# EasyEDA Pro project LED_Haptics_Module.eprj

# Schematic OctoSlime
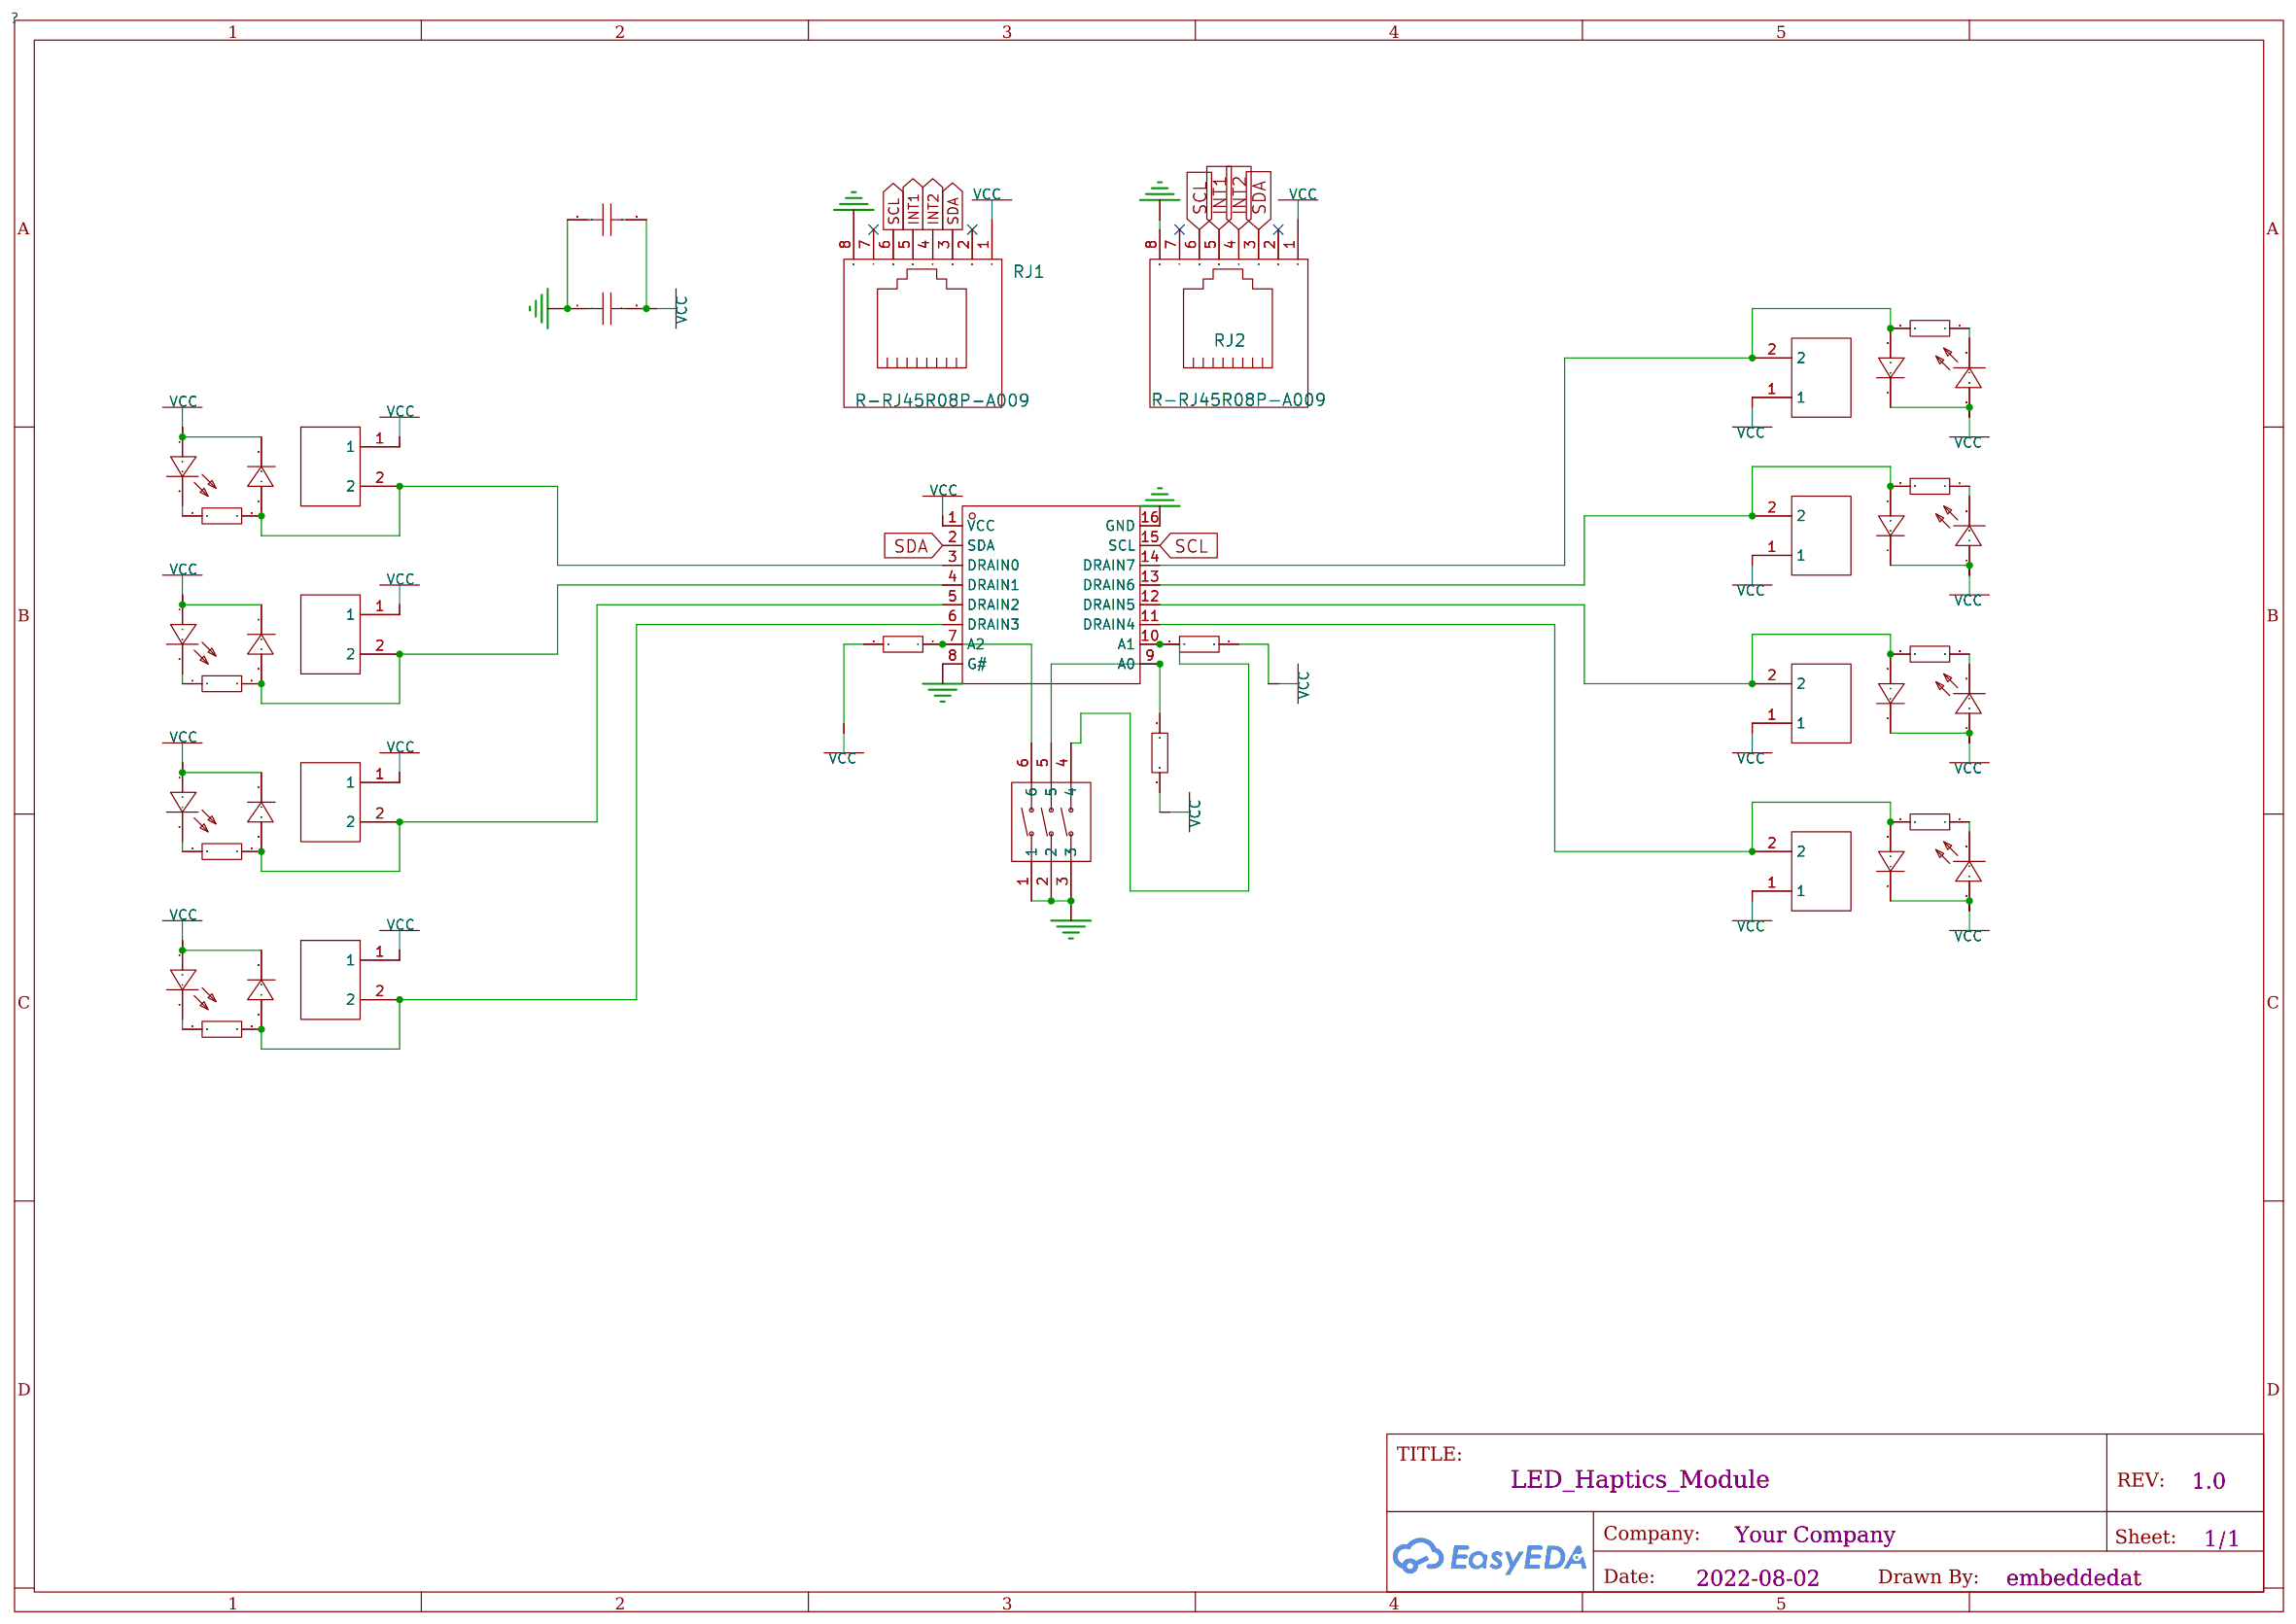
[diagram p0: schematic sheet]

## Parts
C3  47uF  [C1206]
C4  100nF  [C0402]
CN1  B2B-PH-K-S(LF)(SN)  [CONN-TH_B2B-PH-K-S]
CN2  B2B-PH-K-S(LF)(SN)  [CONN-TH_B2B-PH-K-S]
CN3  B2B-PH-K-S(LF)(SN)  [CONN-TH_B2B-PH-K-S]
CN4  B2B-PH-K-S(LF)(SN)  [CONN-TH_B2B-PH-K-S]
CN5  B2B-PH-K-S(LF)(SN)  [CONN-TH_B2B-PH-K-S]
CN6  B2B-PH-K-S(LF)(SN)  [CONN-TH_B2B-PH-K-S]
CN7  B2B-PH-K-S(LF)(SN)  [CONN-TH_B2B-PH-K-S]
CN9  B2B-PH-K-S(LF)(SN)  [CONN-TH_B2B-PH-K-S]
D1  -  [DO-214AC_L4.3-W2.7-LS5.3-RD]
D2  -  [DO-214AC_L4.3-W2.7-LS5.3-RD]
D3  -  [DO-214AC_L4.3-W2.7-LS5.3-RD]
D4  -  [DO-214AC_L4.3-W2.7-LS5.3-RD]
D5  -  [DO-214AC_L4.3-W2.7-LS5.3-RD]
D6  -  [DO-214AC_L4.3-W2.7-LS5.3-RD]
D7  -  [DO-214AC_L4.3-W2.7-LS5.3-RD]
D8  -  [DO-214AC_L4.3-W2.7-LS5.3-RD]
LED1  -  [LED0603-R-RD]
LED2  -  [LED0603-R-RD]
LED3  -  [LED0603-R-RD]
LED4  -  [LED0603-R-RD]
LED5  -  [LED0603-R-RD]
LED6  -  [LED0603-R-RD]
LED7  -  [LED0603-R-RD]
LED8  -  [LED0603-R-RD]
R1  1kΩ  [R0603]
R2  1kΩ  [R0603]
R3  330Ω  [R0603]
R4  330Ω  [R0603]
R5  330Ω  [R0603]
R6  330Ω  [R0603]
R7  330Ω  [R0603]
R8  330Ω  [R0603]
R9  330Ω  [R0603]
R10  330Ω  [R0603]
R20  1kΩ  [R0603]
RJ1  R-RJ45R08P-A009  [RJ45-TH_R-RJ45R08P-A009]
RJ2  R-RJ45R08P-A009  [RJ45-TH_R-RJ45R08P-A009]
SW1  EM-03KP  [SW-SMD_EM-03KP]
U1  TPIC2810DRG4  [SOIC-16_L9.9-W3.9-P1.27-LS6.0-BL]

## Library data of the parts
C3 = CL31A476MPHNNNE: 容值:47uF;精度:±20%;额定电压:10V;温度系数:X5R;; LCSC Part Name: 47uF ±20% 10V; Supplier Part: C96123; Manufacturer: SAMSUNG(三星); Supplier Footprint: 1206; JLCPCB Part Class: Basic Part; Datasheet: https://atta.szlcsc.com/upload/public/pdf/source/20170228/1488267692219.pdf; Supplier: LCSC; Tolerance: ±20%; Voltage Rated: 10V; Temperature Coefficient: X5R
C4 = CL05B104KB54PNC: 容值:100nF;精度:±10%;额定电压:50V;温度系数:X7R;; LCSC Part Name: 100nF ±10% 50V; Supplier Part: C307331; Manufacturer: SAMSUNG(三星); Supplier Footprint: 0402; JLCPCB Part Class: Basic Part; Datasheet: https://atta.szlcsc.com/upload/public/pdf/source/20181009/C307331_222F7C870FD3EA5F46F538B483443886.pdf; Supplier: LCSC; Tolerance: ±10%; Voltage Rated: 50V; Temperature Coefficient: X7R
CN1-CN7 CN9 = B2B-PH-K-S(LF)(SN): link: https://item.szlcsc.com/142630.html; 3DModel: CONN-TH_PH2.00-LI-2P; Supplier: LCSC; Manufacturer: JST; Supplier Part: C131337; JLCPCB Part Class: Extended Part
D1-D8 = M7_C95872: 二极管配置:-;直流反向耐压(Vr):1kV;平均整流电流(Io):1A;正向压降(Vf):1.1V@1A;反向电流(Ir):5A@1kV;; LCSC Part Name: 1kV 1A 1.1V@1A GPP; Supplier Part: C95872; Manufacturer: MDD; Manufacturer Part: M7; Supplier Footprint: SMA(DO-214AC); JLCPCB Part Class: Basic Part; Datasheet: https://atta.szlcsc.com/upload/public/pdf/source/20170221/1487670316366.pdf; Supplier: LCSC; Reverse Voltage (Vr): 1kV; Average Rectified Current (Io): 1A; Forward Voltage (Vf@If): 1.1V@1A; Reverse Leakage Current: 5A@1kV
LED1-LED8 = KT-0603R: 发光颜色:红灯;二极管配置:-;透镜颜色:-;主波长:-;峰值波长:-;色温:-;光通量(25时):-;测试电流:-;正向电压(VF):-;发光强度:-;功率:-;发光角度:-;安装方式:-;工作温度:-40~+85;; LCSC Part Name: 红灯 0603 (90~100mcd); Supplier Part: C2286; Manufacturer: KENTO; Supplier Footprint: 0603; JLCPCB Part Class: Basic Part; Datasheet: https://atta.szlcsc.com/upload/public/pdf/source/20160616/1466072038404.pdf; Supplier: LCSC; Emitted Color: 红灯; Operating Temperature: -40~+85
R1 R2 R20 = 0603WAF1001T5E: 电阻类型:厚膜电阻;阻值:1kΩ;精度:±1%;功率:1/10W;温度系数:±100ppm/;最大工作电压:75V;工作温度范围:-55~+155;; LCSC Part Name: 1kΩ ±1%; Supplier Part: C21190; Manufacturer: UNI-ROYAL(厚声); Supplier Footprint: 0603; JLCPCB Part Class: Basic Part; Datasheet: https://atta.szlcsc.com/upload/public/pdf/source/20200306/C422600_1E6D84923E4A46A82E41ADD87F860B5C.pdf; Supplier: LCSC; Type: 厚膜电阻; Tolerance: ±1%; Power(Watts): 1/10W; Temperature Coefficient: ±100ppm/; Overload Voltage (Max): 75V; Operating Temperature Range: -55~+155
R3-R10 = 0603WAF3300T5E: 电阻类型:厚膜电阻;阻值:330Ω;精度:±1%;功率:1/10W;温度系数:±100ppm/;最大工作电压:75V;工作温度范围:-55~+155;; LCSC Part Name: 330Ω ±1%; Supplier Part: C23138; Manufacturer: UNI-ROYAL(厚声); Supplier Footprint: 0603; JLCPCB Part Class: Basic Part; Datasheet: https://atta.szlcsc.com/upload/public/pdf/source/20200306/C422600_1E6D84923E4A46A82E41ADD87F860B5C.pdf; Supplier: LCSC; Type: 厚膜电阻; Tolerance: ±1%; Power(Watts): 1/10W; Temperature Coefficient: ±100ppm/; Overload Voltage (Max): 75V; Operating Temperature Range: -55~+155
RJ1 RJ2 = R-RJ45R08P-A009: link: https://atta.szlcsc.com/upload/public/pdf/source/20211021/D54662BD8381AD1D1DF920996089EE18.pdf; Supplier: LCSC; Supplier Part: C2902700; Manufacturer: Ckmtw(灿科盟); JLCPCB Part Class: Extended Part
SW1 = EM-03KP: link: https://item.szlcsc.com/140371.html; 3DModel: SW-SMD_EM-03KP-L8.6-W6.3-H4.8-P2.54-LS10.0; Supplier: LCSC; Manufacturer: HRO; Supplier Part: C129079; JLCPCB Part Class: Extended Part
U1 = TPIC2810DRG4: 3DModel: SOIC-16_L9.9-W3.9-H1.8-LS6.0-P1.27; Supplier: LCSC; Supplier Part: C2678987; Manufacturer: TI(德州仪器); JLCPCB Part Class: Extended Part

## Nets
GND: C3.1 C4.1 RJ1.8 RJ2.8 SW1.1 SW1.2 SW1.3 U1.8(G#) U1.16(GND)
VCC: C3.2 C4.2 CN1.1 CN2.1 CN3.1 CN4.1 CN5.1 CN6.1 CN7.1 CN9.1 D1.1(K) D2.1(K) D3.1(K) D4.1(K) D5.1(K) D6.1(K) D7.1(K) D8.1(K) LED1.1(A) LED2.1(A) LED3.1(A) LED4.1(A) LED5.1(A) LED6.1(A) LED7.1(A) LED8.1(A) R1.2 R2.2 R20.1 RJ1.1 RJ2.1 U1.1(VCC)
INT1: RJ1.5 RJ2.5
INT2: RJ1.4 RJ2.4
SCL: RJ1.6 RJ2.6 U1.15(SCL)
SDA: RJ1.3 RJ2.3 U1.2(SDA)
$1N1698: R20.2 SW1.4 U1.10(A1)
$1N1704: R1.1 SW1.5 U1.9(A0)
$1N1718: R2.1 SW1.6 U1.7(A2)
$1N1725: CN3.2 D4.2(A) R6.2 U1.3(DRAIN0)
$1N1752: CN1.2 D2.2(A) R4.2 U1.5(DRAIN2)
$1N1840: CN4.2 D5.2(A) R7.2 U1.14(DRAIN7)
$1N1848: CN5.2 D6.2(A) R8.2 U1.13(DRAIN6)
$1N1856: CN6.2 D7.2(A) R9.2 U1.12(DRAIN5)
$1N24704: CN9.2 D1.2(A) R3.2 U1.6(DRAIN3)
$1N25961: CN2.2 D3.2(A) R5.2 U1.4(DRAIN1)
$1N26082: CN7.2 D8.2(A) R10.2 U1.11(DRAIN4)
$1N30806: LED1.2(K) R3.1
$1N30961: LED2.2(K) R4.1
$1N31148: LED3.2(K) R5.1
$1N31259: LED4.2(K) R6.1
$1N31402: LED5.2(K) R7.1
$1N31541: LED6.2(K) R8.1
$1N31676: LED7.2(K) R9.1
$1N31807: LED8.2(K) R10.1

Not connected (* = marked no-connect by the designer): RJ1 2* 7*; RJ2 2* 7*

# Board PCB_PCB_OctoSlime_2022-08-02
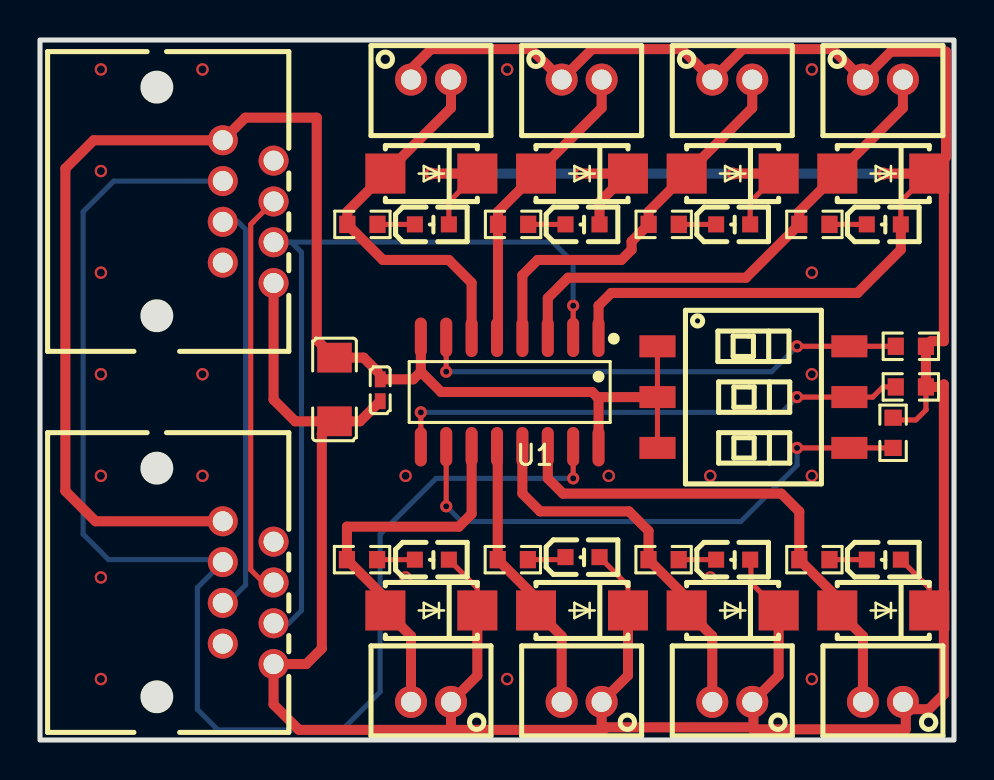
[diagram p1: board, top side]
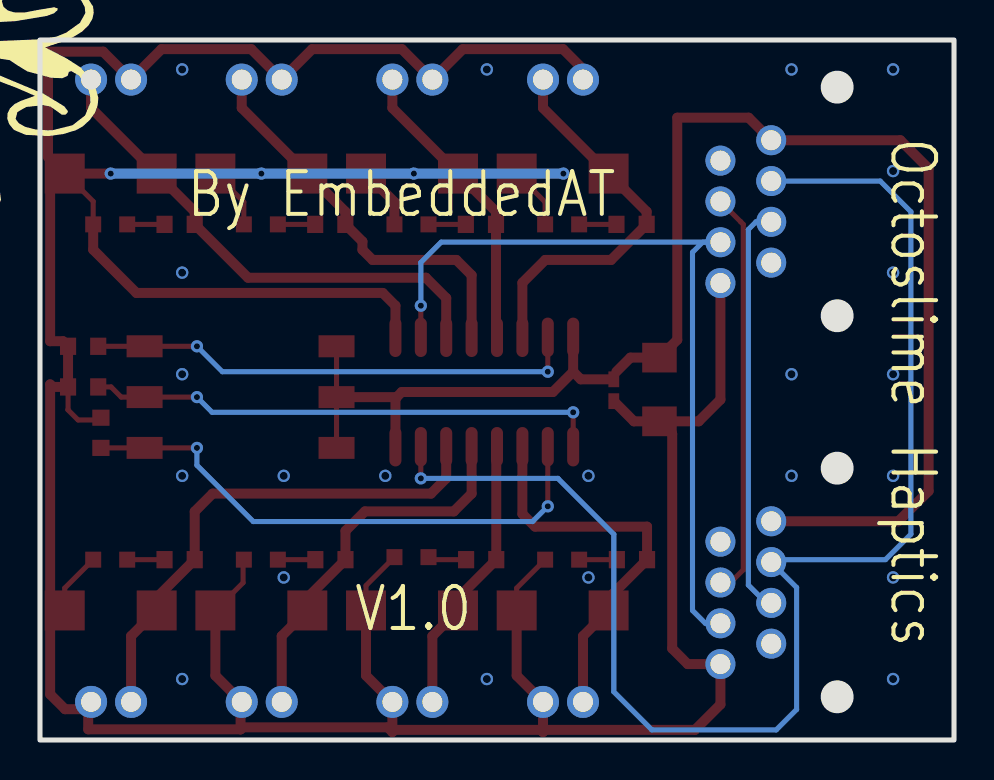
[diagram p2: board, bottom side, seen from below]

Outline 45.72 x 35 mm; copper layers: Top Layer, Bottom Layer. Coordinates in mm from the lower left corner of the outline.
Outline path: rectangle 0,35 45.72,0
Stack: Top Layer 0.035mm / Dielectric1 1.51mm FR4 er 4.5 / Bottom Layer 0.035mm

## Design rules (mm)
spacing Default (default): track to track 0.152, other pairs 0 to 0.152
track width Default (default): min 0.254, default 0.254, max 25.4
differential pair differentialPair (default): width min 0.127, default 0.254, max 2.54; gap min 0.152, default 0.152
via Default (default): diameter min 0.61, default 0.61, max 100.025; hole min 0.305, default 0.305, max 59.995

## Placement (name value [footprint] x y rotation side)
C3  47uF  [C1206]  14.73 17.53 270 top
C4  100nF  [C0402]  17.02 17.49 270 top
CN1  B2B-PH-K-S(LF)(SN)  [CONN-TH_B2B-PH-K-S]  27.09 33.02 180 top
CN2  B2B-PH-K-S(LF)(SN)  [CONN-TH_B2B-PH-K-S]  34.63 33.02 180 top
CN3  B2B-PH-K-S(LF)(SN)  [CONN-TH_B2B-PH-K-S]  42.16 33.02 180 top
CN4  B2B-PH-K-S(LF)(SN)  [CONN-TH_B2B-PH-K-S]  42.16 1.91 0 top
CN5  B2B-PH-K-S(LF)(SN)  [CONN-TH_B2B-PH-K-S]  34.63 1.91 0 top
CN6  B2B-PH-K-S(LF)(SN)  [CONN-TH_B2B-PH-K-S]  27.09 1.91 0 top
CN7  B2B-PH-K-S(LF)(SN)  [CONN-TH_B2B-PH-K-S]  19.56 1.91 0 top
CN9  B2B-PH-K-S(LF)(SN)  [CONN-TH_B2B-PH-K-S]  19.56 33.02 180 top
D1  -  [DO-214AC_L4.3-W2.7-LS5.3-RD]  19.58 28.32 180 top
D2  -  [DO-214AC_L4.3-W2.7-LS5.3-RD]  27.11 28.32 180 top
D3  -  [DO-214AC_L4.3-W2.7-LS5.3-RD]  34.65 28.32 180 top
D4  -  [DO-214AC_L4.3-W2.7-LS5.3-RD]  42.18 28.32 180 top
D5  -  [DO-214AC_L4.3-W2.7-LS5.3-RD]  42.18 6.48 180 top
D6  -  [DO-214AC_L4.3-W2.7-LS5.3-RD]  34.65 6.48 180 top
D7  -  [DO-214AC_L4.3-W2.7-LS5.3-RD]  27.11 6.48 180 top
D8  -  [DO-214AC_L4.3-W2.7-LS5.3-RD]  19.58 6.48 180 top
LED1  -  [LED0603-R-RD]  19.6 25.78 0 top
LED2  -  [LED0603-R-RD]  27.14 25.78 0 top
LED3  -  [LED0603-R-RD]  34.67 25.78 0 top
LED4  -  [LED0603-R-RD]  42.21 25.78 0 top
LED5  -  [LED0603-R-RD]  42.21 9.02 0 top
LED6  -  [LED0603-R-RD]  34.67 9.02 0 top
LED7  -  [LED0603-R-RD]  27.14 9.14 0 top
LED8  -  [LED0603-R-RD]  19.6 9.02 0 top
R1  1kΩ  [R0603]  43.56 17.65 0 top
R2  1kΩ  [R0603]  43.56 19.69 0 top
R3  330Ω  [R0603]  16.13 25.78 180 top
R4  330Ω  [R0603]  23.66 25.78 180 top
R5  330Ω  [R0603]  31.2 25.78 180 top
R6  330Ω  [R0603]  38.73 25.78 180 top
R7  330Ω  [R0603]  38.73 9.02 180 top
R8  330Ω  [R0603]  31.19 9.02 180 top
R9  330Ω  [R0603]  23.65 9.02 180 top
R10  330Ω  [R0603]  16.11 9.02 180 top
R20  1kΩ  [R0603]  42.67 15.36 270 top
RJ1  R-RJ45R08P-A009  [RJ45-TH_R-RJ45R08P-A009]  10.41 7.37 270 top
RJ2  R-RJ45R08P-A009  [RJ45-TH_R-RJ45R08P-A009]  10.41 26.42 270 top
SW1  EM-03KP  [SW-SMD_EM-03KP]  35.69 17.14 270 top
U1  TPIC2810DRG4  [SOIC-16_L9.9-W3.9-P1.27-LS6.0-BL]  23.49 17.4 180 top

## Footprints (pads in the part's own frame, mm; a bottom-side part is the same pattern mirrored in y, then rotated)
C0402
  rect 0.79x0.541 smd: 1(-0.546,0) 2(0.546,0)
C1206
  rect 1.486x1.727 smd: 1(-1.593,0) 2(1.593,0)
CONN-TH_B2B-PH-K-S
  round 1.6 hole 1: 1(1,0) 2(-1,0)
DO-214AC_L4.3-W2.7-LS5.3-RD
  rect 1.999x1.999 smd: 1(-2.299,0) 2(2.301,0)
LED0603-R-RD
  rect 0.8x0.8 smd: 1(0.851,0) 2(-0.851,0)
R0603
  rect 0.807x0.864 smd: 1(-0.754,0) 2(0.754,0)
RJ45-TH_R-RJ45R08P-A009
  round 1.5 hole 1: 1(3.57,1.27) 2(2.55,-1.27) 3(1.53,1.27) 4(0.51,-1.27) 5(-0.51,1.27) 6(-1.53,-1.27) 7(-2.55,1.27) 8(-3.57,-1.27)
SOIC-16_L9.9-W3.9-P1.27-LS6.0-BL
  oval 0.602x1.971 smd: 1(-4.445,-2.736) 2(-3.175,-2.736) 3(-1.905,-2.736) 4(-0.635,-2.736) 5(0.635,-2.736) 6(1.905,-2.736) 7(3.175,-2.736) 8(4.445,-2.736) 9(4.445,2.736) 10(3.175,2.736) 11(1.905,2.736) 12(0.635,2.736) 13(-0.635,2.736) 14(-1.905,2.736) 15(-3.175,2.736) 16(-4.445,2.736)
SW-SMD_EM-03KP
  rect 1.1x1.8 smd: 1(-2.54,-4.8) 2(0,-4.8) 3(2.54,-4.8) 4(2.54,4.8) 5(0,4.8) 6(-2.54,4.8)

## Nets
As in the schematic.

Pads without a net: RJ1 2 7; RJ2 2 7

## Via types
v1: diameter 0.61, hole 0.305, Top Layer to Bottom Layer, 12 vias
v2: diameter 0.62, hole 0.4, Top Layer to Bottom Layer, 22 vias

## Routing (per net, layer and track width the routed paths; a pad name or vN(x,y) marks a point on that pad's centre or on a via; arc(x,y) is an arc through that point)
GND: length 76.9
  Top Layer w0.254: SW1.1 SW1.2 SW1.3 ; 19.05,19.33 U1.8
  Top Layer w0.5: 19.05,18.42 20.07,17.4 27.62,17.4 27.88,17.14 ; 19.05,18.42 18.67,18.03 C4.1 ; 19.05,18.42 19.05,19.33 ; 27.88,17.14 SW1.2 ; 27.88,17.14 27.94,17.08 U1.16 ; 16.89,18.42 16.19,19.12 C3.1 13.84,20.01 13.84,31.11 10.27,31.11 RJ2.8 2.68,29.99 1.27,28.58 1.27,12.45 2.78,10.94 RJ1.8
  vias: v2(3.05,33.53) v2(3.05,28.45) v2(3.05,23.37) v2(3.05,18.29) v2(3.05,13.21) v2(3.05,8.13) v2(3.05,3.05) v2(8.13,33.53) v2(8.13,18.29) v2(8.13,13.21) v2(18.29,13.21) v2(18.29,8.13) v2(23.37,33.53) v2(23.37,3.05) v2(28.45,13.21) v2(33.53,13.21) v2(33.53,8.13) v2(38.61,33.53) v2(38.61,23.37) v2(38.61,18.29) v2(38.61,13.21) v2(38.61,3.05)
VCC: length 230.5
  Top Layer w0.254: D5.1 44.48,7.59 LED5.1 ; 42.67,16.11 42.78,16 43.82,16 44.32,16.51 44.32,16.52 R1.2 ; CN5.1 35.82,1.91 ; LED3.1 35.52,26.9 D3.1 ; 27.99,9.14 29.41,7.72 D7.1 ; 44.45,28.32 43.06,26.93 LED4.1 ; D6.1 35.56,7.86 35.56,8.98 LED6.1 ; LED1.1 20.45,26.9 D1.1 ; D8.1 21.88,7.59 LED8.1
  Top Layer w0.5: 35.69,0.53 35.58,0.64 28.33,0.64 28.09,0.4 ; 35.69,0.53 35.69,1.77 35.82,1.91 ; 35.69,0.53 43.31,0.53 43.31,1.76 ; 28.09,0.4 CN6.1 29.41,3.22 D7.1 ; 28.09,0.4 27.99,0.51 20.66,0.51 20.56,0.4 ; v1(34.65,28.32) D3.1 ; CN9.1 18.56,33.54 19.56,34.54 24.57,34.54 CN1.1 27.62,34.54 32.1,34.54 CN2.1 35.15,34.54 39.64,34.54 CN3.1 42.56,34.42 45.32,34.42 45.32,29.16 D4.1 45.21,27.59 45.21,19.94 44.57,19.94 R2.2 R1.2 45.08,17.65 45.21,17.78 45.21,7.21 D5.1 45.21,5.75 45.21,2.29 44.47,1.54 43.53,1.54 43.31,1.76 ; C3.2 14.1,15.3 14.1,4.57 13.32,3.8 RJ1.1 11.68,1.78 12.95,0.51 20.45,0.51 20.56,0.4 ; C3.2 16.01,15.93 C4.2 ; C3.2 12.77,15.93 11.68,17.02 11.68,22.85 ; 43.31,1.76 CN4.1 ; D6.1 36.95,3.22 CN5.1 ; 20.56,0.4 CN7.1 21.88,3.22 D8.1 ; 27.99,25.78 27.99,26.9 D2.1 v1(27.02,28.32) ; LED4.1 43.06,24.52 40.89,22.35 28.58,22.35 27.94,21.72 U1.1 ; v1(19.54,28.32) D1.1 ; v1(42.18,28.32) 44.45,28.32
  Bottom Layer w0.5: v1(19.54,28.32) v1(27.02,28.32) v1(34.65,28.32) v1(42.18,28.32)
INT1: length 20.3
  Top Layer w0.254: 11.68,26.93 10.67,25.91 10.67,25.91 10.54,25.78 10.54,8.51 11.17,7.88 RJ1.5
INT2: length 20.6
  Bottom Layer w0.254: RJ2.4 9.91,25.91 10.29,25.53 10.29,7.75 9.4,6.86 RJ1.4
SCL: length 69.8
  Top Layer w0.254: U1.15 v1(26.67,13.08)
  Bottom Layer w0.254: v1(26.67,13.08) 19.81,13.08 17.02,10.29 17.02,2.41 15.11,0.51 8.89,0.51 7.87,1.52 7.87,7.63 RJ1.6 9.02,9.02 3.43,9.02 2.16,10.29 2.16,26.42 3.69,27.95 9.14,27.95
SDA: length 40.2
  Top Layer w0.254: v1(26.67,21.72) U1.2
  Bottom Layer w0.254: RJ2.3 11.86,24.89 ; 11.86,24.89 11.86,24.89 25.65,24.89 26.67,23.88 v1(26.67,21.72) ; 11.86,24.89 12.58,24.89 13.08,24.38 13.08,6.48 12.44,5.84 RJ1.3
$1N1698: length 27.7
  Top Layer w0.254: R20.2 SW1.4 v1(37.87,14.61) ; v1(20.32,11.68) U1.10
  Bottom Layer w0.254: v1(20.32,11.68) 21.08,10.92 35.05,10.92 37.87,13.74 v1(37.87,14.61)
$1N1704: length 26
  Top Layer w0.254: v1(19.05,16.38) U1.9 ; R1.1 42.16,17.65 41.66,17.14 SW1.5 v1(37.87,17.14)
  Bottom Layer w0.254: v1(19.05,16.38) 37.11,16.38 v1(37.87,17.14)
$1N1718: length 24.7
  Top Layer w0.254: v1(37.87,19.69) SW1.6 R2.1 ; v1(20.32,18.42) U1.7
  Bottom Layer w0.254: v1(20.32,18.42) 36.6,18.42 v1(37.87,19.69)
$1N1725: length 25.5
  Top Layer w0.5: U1.3 25.4,22.1 26.42,23.11 35.31,23.11 R6.2 37.98,26.42 D4.2 43.16,31.6 CN3.2
$1N1752: length 15.1
  Top Layer w0.5: U1.5 22.91,20.18 22.91,26.42 D2.2 28.09,31.6 CN1.2
$1N1840: length 25.7
  Top Layer w0.5: CN4.2 41.16,5.2 D5.2 39.88,7.11 R7.2 37.98,11.42 37.08,12.32 26.16,12.32 25.4,13.08 U1.14
$1N1848: length 19.3
  Top Layer w0.5: 24.13,14.66 24.13,12.32 25.02,11.43 29.46,11.43 30.44,10.46 R8.2 32.35,7.11 D6.2 33.63,5.2 CN5.2
$1N1856: length 14.1
  Top Layer w0.5: CN6.2 26.09,5.2 D7.2 24.81,7.1 R9.2 22.9,14.63 U1.12
$1N24704: length 19.5
  Top Layer w0.5: U1.6 21.59,22.86 20.45,24 17.15,24 R3.2 15.37,26.42 D1.2 20.56,31.6 CN9.2
$1N25961: length 20.1
  Top Layer w0.5: CN2.2 35.63,31.6 D3.2 30.45,26.42 R5.2 29.59,24.93 29.59,24.51 29.08,24 24.89,24 24.13,23.24 24.13,20.13
$1N26082: length 19.9
  Top Layer w0.5: U1.11 21.59,11.3 20.95,10.67 15.35,10.67 R10.2 17.28,7.09 D8.2 18.56,5.2 CN7.2
$1N30806: length 1.9
  Top Layer w0.254: R3.1 LED1.2
$1N30961: length 1.9
  Top Layer w0.254: R4.1 LED2.2
$1N31148: length 1.9
  Top Layer w0.254: R5.1 LED3.2
$1N31259: length 1.9
  Top Layer w0.254: R6.1 LED4.2
$1N31402: length 1.9
  Top Layer w0.254: LED5.2 R7.1
$1N31541: length 1.9
  Top Layer w0.254: LED6.2 R8.1
$1N31676: length 1.9
  Top Layer w0.254: LED7.2 26.16,9.02 R9.1
$1N31807: length 1.9
  Top Layer w0.254: LED8.2 R10.1

## Copper pours and planes (outline as drawn; the poured copper is in the pictures)
GND on Top Layer: -1.27,35.94 46.86,35.94 46.86,-1.65 -1.27,-1.65
GND on Bottom Layer: -2.03,36.45 46.48,36.45 46.48,-2.03 -2.03,-2.03

## Text on the board
Bottom Silkscreen Layer: V1.0 | By EmbeddedAT | Octoslime | Haptics
